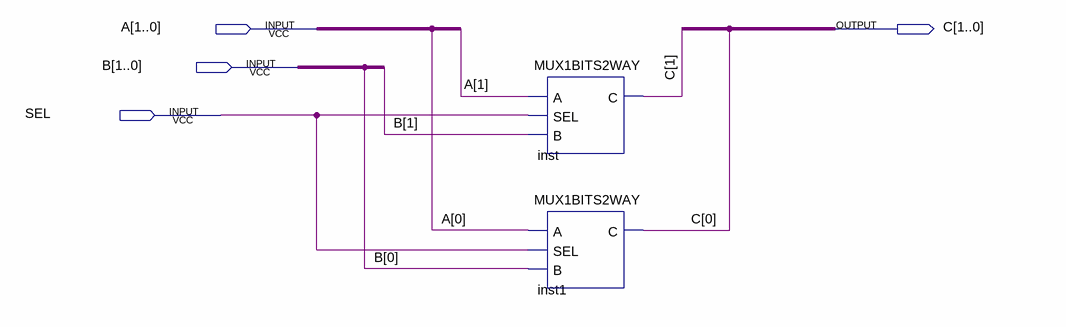
[diagram p0: schematic sheet]
// Quartus schematic MUX2bit2way.bdf as structural Verilog: 2 symbols, 4 pins
module MUX2bit2way (
  input  [1:0] A,
  input  [1:0] B,
  input  SEL,
  output [1:0] C
);

  MUX1BITS2WAY inst (.A(A[1]), .SEL(SEL), .B(B[1]), .C(C[1]));
  MUX1BITS2WAY inst1 (.A(A[0]), .SEL(SEL), .B(B[0]), .C(C[0]));
endmodule
